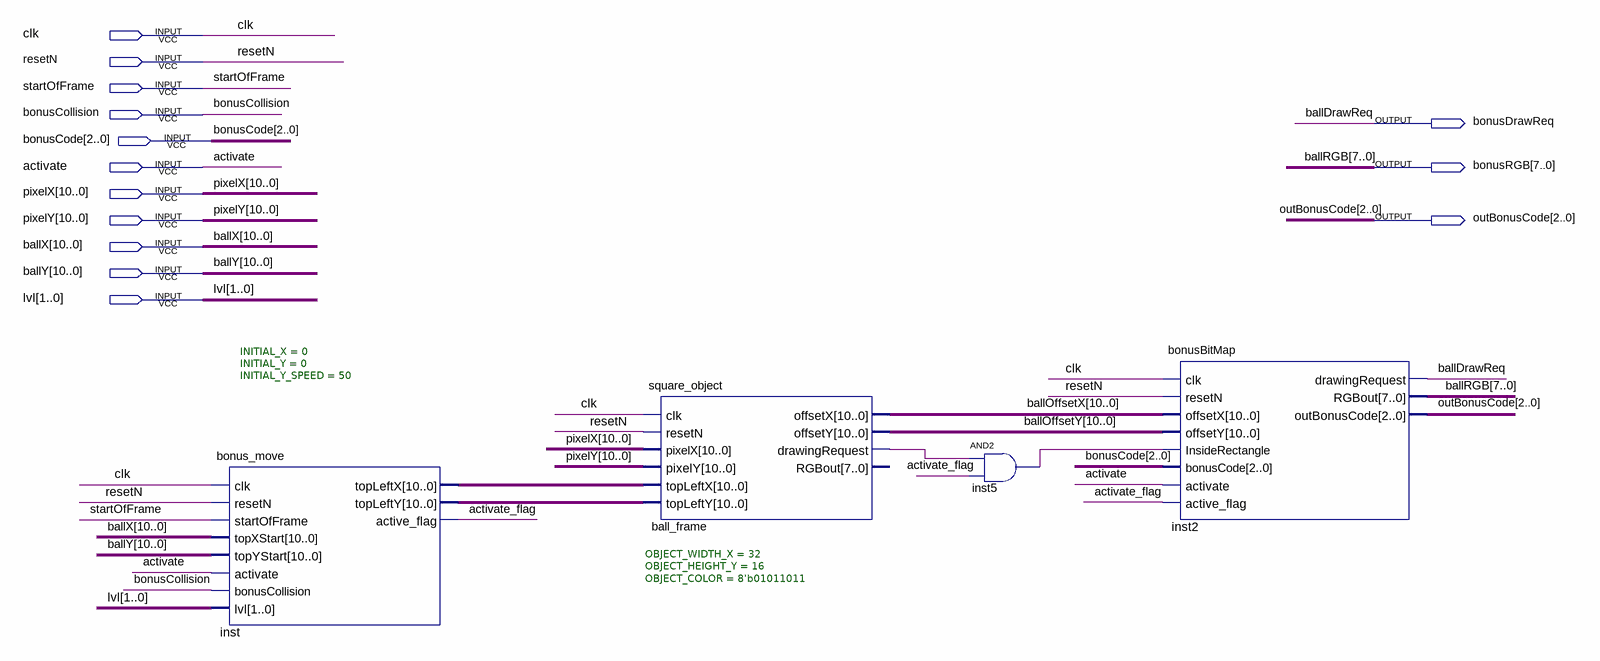
[diagram p0: schematic sheet]
// Quartus schematic oneBonus.bdf as structural Verilog: 4 symbols, 14 pins
module oneBonus (
  input  clk,
  input  resetN,
  input  startOfFrame,
  input  bonusCollision,
  input  [2:0] bonusCode,
  input  activate,
  input  [10:0] pixelX,
  input  [10:0] pixelY,
  input  [10:0] ballX,
  input  [10:0] ballY,
  input  [1:0] lvl,
  output bonusDrawReq,
  output [7:0] bonusRGB,
  output [2:0] outBonusCode
);

  wire activate_flag, ball_frame_drawingrequest, inst5_out;
  wire [10:0] ballOffsetX, ballOffsetY, inst_topleftx, inst_toplefty;

  bonus_move #(.INITIAL_X(0), .INITIAL_Y(0), .INITIAL_Y_SPEED(50)) inst (
    .clk(clk), .resetN(resetN), .startOfFrame(startOfFrame), .topXStart(ballX), .topYStart(ballY),
    .activate(activate), .bonusCollision(bonusCollision), .lvl(lvl), .topLeftX(inst_topleftx),
    .topLeftY(inst_toplefty), .active_flag(activate_flag));
  square_object #(.OBJECT_WIDTH_X(32), .OBJECT_HEIGHT_Y(16), .OBJECT_COLOR(8'b01011011)) ball_frame (
    .clk(clk), .resetN(resetN), .pixelX(pixelX), .pixelY(pixelY), .topLeftX(inst_topleftx),
    .topLeftY(inst_toplefty), .offsetX(ballOffsetX), .offsetY(ballOffsetY),
    .drawingRequest(ball_frame_drawingrequest));  // open: RGBout
  and inst5 (inst5_out, ball_frame_drawingrequest, activate_flag);
  bonusBitMap inst2 (
    .clk(clk), .resetN(resetN), .offsetX(ballOffsetX), .offsetY(ballOffsetY), .InsideRectangle(inst5_out),
    .bonusCode(bonusCode), .activate(activate), .active_flag(activate_flag), .drawingRequest(bonusDrawReq),
    .RGBout(bonusRGB), .outBonusCode(outBonusCode));

  // Other names for the same wires on the sheet: ballDrawReq = bonusDrawReq; ballRGB[7:0] = bonusRGB
endmodule
